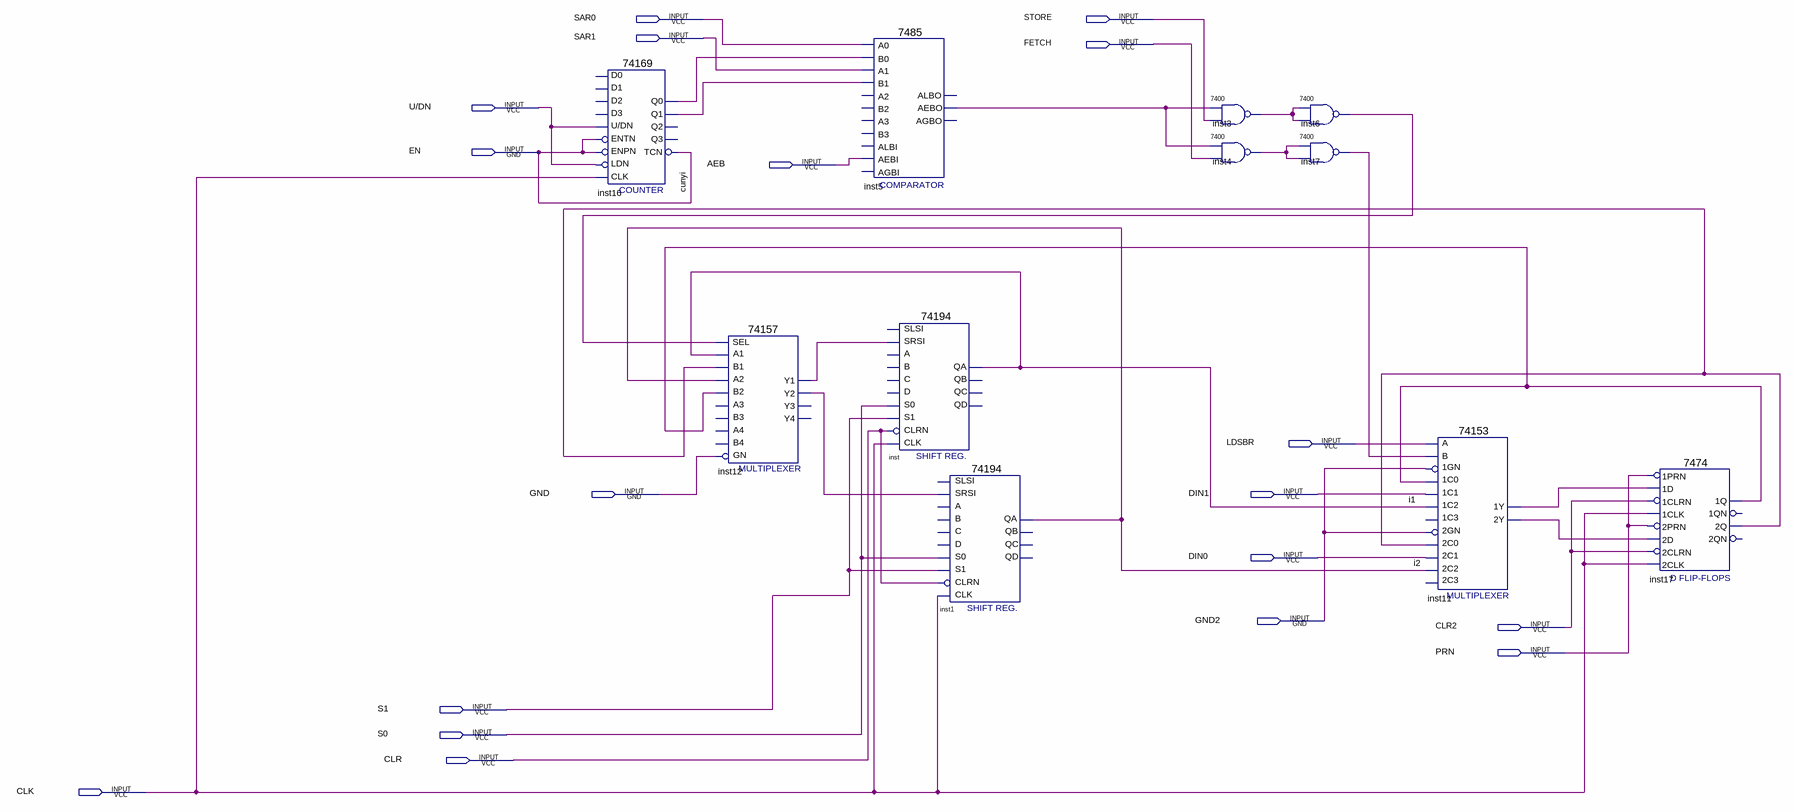
[diagram p0: schematic sheet]
// Quartus schematic Block1.bdf as structural Verilog: 11 symbols, 18 pins
module Block1 (
  input  SAR0,
  input  STORE,
  input  SAR1,
  input  FETCH,
  input  \U/DN ,
  input  EN,
  input  AEB,
  input  LDSBR,
  input  GND,
  input  DIN1,
  input  DIN0,
  input  GND2,
  input  CLR2,
  input  PRN,
  input  S1,
  input  S0,
  input  CLR,
  input  CLK
);

  wire i1, i2, inst3_1, inst4_1, inst5_aebo, inst6_1, inst7_1, inst11_1y, inst11_2y, inst12_y1, inst12_y2,
       inst16_q0, inst16_q1, inst17_1q, inst17_2q;

  \74169  inst16 (
    .ENTN(EN), .\U/DN (\U/DN ), .LDN(\U/DN ), .CLK(CLK), .ENPN(EN), .Q1(inst16_q1), .Q0(inst16_q0), .TCN(EN));  // open: D1, D2, D0, D3, Q2, Q3
  \74157  inst12 (
    .A1(i1), .B1(inst17_2q), .SEL(inst6_1), .B2(inst17_1q), .A2(i2), .GN(GND), .Y2(inst12_y2), .Y1(inst12_y1));  // open: A3, B3, B4, A4, Y4, Y3
  \7485  inst5 (
    .AEBI(AEB), .A0(SAR0), .B0(inst16_q0), .A1(SAR1), .B1(inst16_q1), .AEBO(inst5_aebo));  // open: A3, B2, A2, AGBI, ALBI, B3, ALBO, AGBO
  \74194  inst (
    .SRSI(inst12_y1), .CLK(CLK), .CLRN(CLR), .S1(S1), .S0(S0), .QA(i1));  // open: SLSI, B, C, D, A, QB, QC, QD
  \74194  inst1 (
    .SRSI(inst12_y2), .CLK(CLK), .CLRN(CLR), .S1(S1), .S0(S0), .QA(i2));  // open: SLSI, B, C, D, A, QB, QC, QD
  \7400  inst3 (.\3 (STORE), .\2 (inst5_aebo), .\1 (inst3_1));
  \7400  inst4 (.\3 (FETCH), .\2 (inst5_aebo), .\1 (inst4_1));
  \7400  inst6 (.\3 (inst3_1), .\2 (inst3_1), .\1 (inst6_1));
  \7400  inst7 (.\3 (inst4_1), .\2 (inst4_1), .\1 (inst7_1));
  \74153  inst11 (
    .\1C1 (DIN1), .\1GN (GND2), .\1C0 (inst17_1q), .\2C0 (inst17_2q), .\2GN (GND2), .\2C2 (i2), .\1C2 (i1),
    .B(inst7_1), .A(LDSBR), .\2C1 (DIN0), .\1Y (inst11_1y), .\2Y (inst11_2y));  // open: 1C3, 2C3
  \7474  inst17 (
    .\2D (inst11_2y), .\2PRN (PRN), .\1CLK (CLK), .\1D (inst11_1y), .\1PRN (PRN), .\2CLK (CLK),
    .\2CLRN (CLR2), .\1CLRN (CLR2), .\2Q (inst17_2q), .\1Q (inst17_1q));  // open: 1QN, 2QN

  // Other names for the same wires on the sheet: cunyi = EN
endmodule
